# Altium schematic sheet nguyenly.SchDoc
size A; SheetNumber: 1; SheetTotal: 1
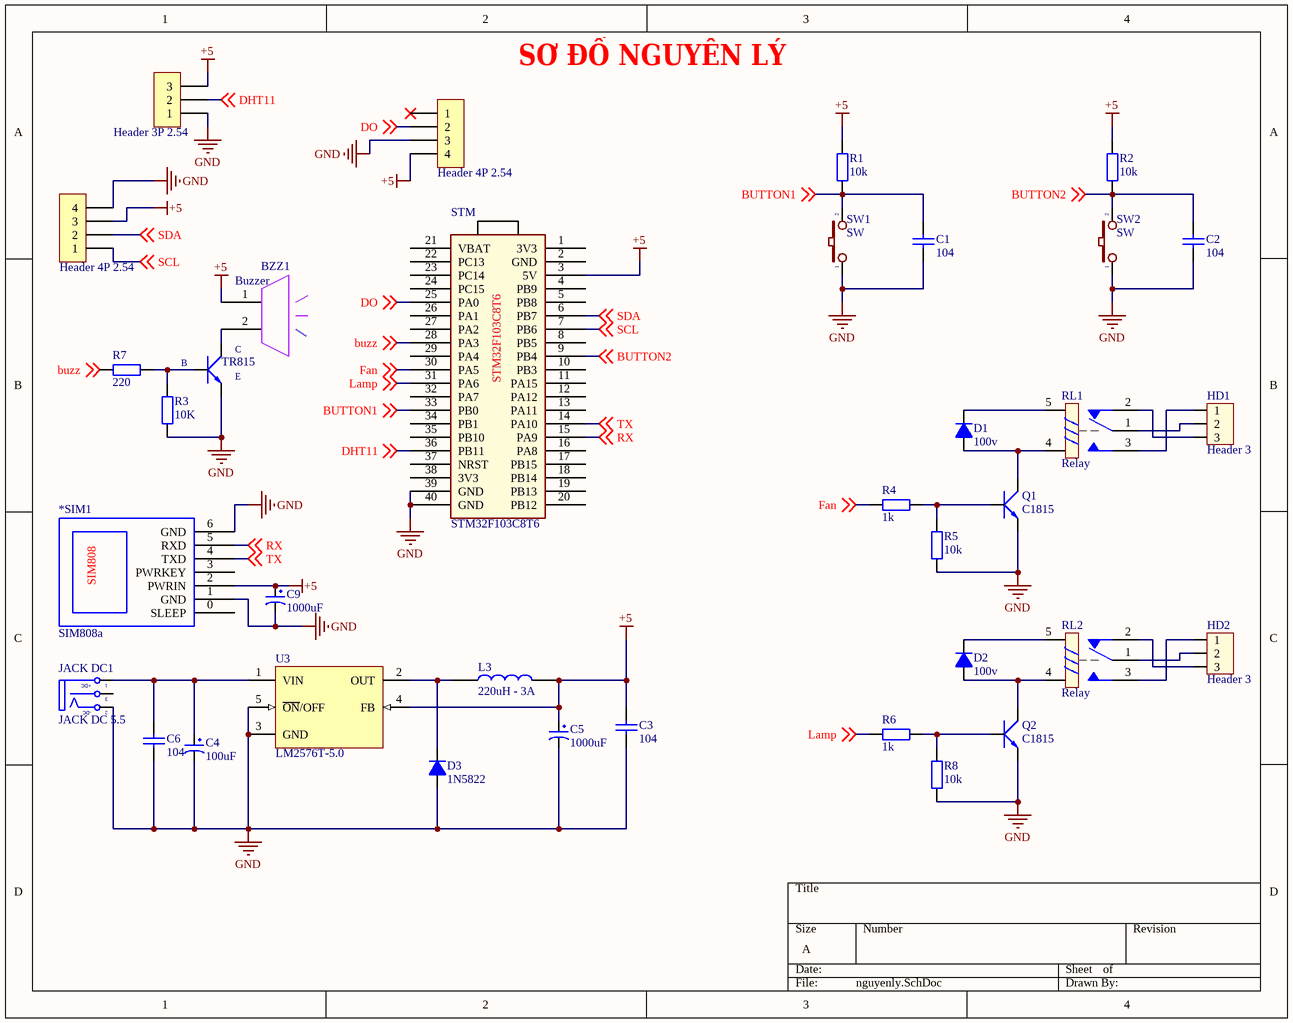
[diagram p0: nguyenly.SchDoc]

## Parts
*SIM1  SIM808a  [PCBComponent_1]
BZZ1  Buzzer  [buzzer 5V]
C1  104  [tu gom]
C2  104  [tu gom]
C3  104  [tu gom]
C4  100uF  [tu hoa 5mm]
C5  1000uF  [tu hoa 5mm]
C6  104  [tu gom]
C9  1000uF  [tu hoa 13mm]
D1  100v  [DIODE 1A]
D2  100v  [DIODE 1A]
D3  1N5822  [D5A]
H1  Header 4P 2.54  [XH2.54M-4]
H2  Header 3P 2.54  [XH2.54M-3]
H3  Header 4P 2.54  [XH2.54M-4]
HD1  Header 3  [HED3]
HD2  Header 3  [HED3]
JACK_DC1  JACK DC 5.5  [JACK DC 5.5]
L3  220uH - 3A  [CUON CAM 100uH3A]
Q1  C1815  [TO92]
Q2  C1815  [TO92]
R1  10k  [tro vach 1/2w]
R2  10k  [tro vach 1/2w]
R3  10K  [tro vach 1/2w]
R4  1k  [tro vach 1/2w]
R5  10k  [tro vach 1/2w]
R6  1k  [tro vach 1/2w]
R7  220  [tro vach 1/2w]
R8  10k  [tro vach 1/2w]
RL1  Relay  [Relay 5 Chan SRD]
RL2  Relay  [Relay 5 Chan SRD]
STA.TR1  TR815  [QTO-92]
STM  STM32F103C8T6  [PCBComponent_1]
SW1  SW  [SW2]
SW2  SW  [SW2]
U3  LM2576T-5.0  [LM2576t]

## Nets
+5: *SIM1.2(PWRIN) BZZ1.1 C3.1 C5.1 C9.1 H1.4 H2.3 H3.3 L3.2 R1.2 R2.2 STM.3(5V) U3.4(FB)
GND: *SIM1.1(GND) *SIM1.6(GND) C1.2 C2.2 C3.2 C4.2 C5.2 C6.2 C9.2 D3.1(A) H1.3 H2.1 H3.4 JACK_DC1.2(TN) Q1.1(E) Q2.1(E) R3.1 R5.1 R8.1 STA.TR1.1(E) STM.39(GND) STM.40(GND) SW1.1 SW2.1 U3.3(GND) U3.5(~{ON}/OFF)
BUTTON1: C1.1 R1.1 STM.33(PB0) SW1.2 ; off-sheet BUTTON1
BUTTON2: C2.1 R2.1 STM.9(PB4) SW2.2 ; off-sheet BUTTON2
buzz: R7.1 STM.28(PA3) ; off-sheet buzz
DHT11: H2.2 STM.36(PB11) ; off-sheet DHT11
DO: H1.2 STM.25(PA0) ; off-sheet DO
Fan: R4.1 STM.30(PA5) ; off-sheet Fan
Lamp: R6.1 STM.31(PA6) ; off-sheet Lamp
RX: *SIM1.5(RXD) STM.15(PA9) ; off-sheet RX
SCL: H3.1 STM.7(PB6) ; off-sheet SCL
SDA: H3.2 STM.6(PB7) ; off-sheet SDA
TX: *SIM1.4(TXD) STM.14(PA10) ; off-sheet TX
NetBZZ1_2: BZZ1.2 STA.TR1.2(C)
NetC4_1: C4.1 C6.1 JACK_DC1.1(T) U3.1(VIN)
NetD1_1: D1.1(A) Q1.2(C) RL1.4
NetD1_2: D1.2(K) RL1.5
NetD2_1: D2.1(A) Q2.2(C) RL2.4
NetD2_2: D2.2(K) RL2.5
NetD3_2: D3.2(K) L3.1 U3.2(OUT)
NetHD1_1: HD1.1 RL1.3
NetHD1_2: HD1.2 RL1.1
NetHD1_3: HD1.3 RL1.2
NetHD2_1: HD2.1 RL2.3
NetHD2_2: HD2.2 RL2.1
NetHD2_3: HD2.3 RL2.2
NetQ1_3: Q1.3(B) R4.2 R5.2
NetQ2_3: Q2.3(B) R6.2 R8.2
NetR3_2: R3.2 R7.2 STA.TR1.3(B)

Not connected (* = marked no-connect by the designer): *SIM1 0(SLEEP) 3(PWRKEY); H1 1*; JACK_DC1 3(S); STM 1(3V3) 2(GND) 4(PB9) 5(PB8) 8(PB5) 10(PB3) 11(PA15) 12(PA12) 13(PA11) 16(PA8) 17(PB15) 18(PB14) 19(PB13) 20(PB12) 21(VBAT) 22(PC13) 23(PC14) 24(PC15) 26(PA1) 27(PA2) 29(PA4) 32(PA7) 34(PB1) 35(PB10) 37(NRST) 38(3V3)

## Notes on the sheet
- SƠ ĐỒ NGUYÊN LÝ
- (in symbol JACK DC 5.5) +DC; -DC
- (in symbol SIM808a) SIM808

## Library data of the parts
C1-C3 C6 = Tu gom 104 50V: Cắm; So_Chan: 2; Ten_Linh_Kien: Tụ gốm 104 100nF 50V; Don_Vi: Con; Ma_Hang: MH004761; Chung_Loai: Cắm; Kieu_Chan: *
C4 C5 = Tu Hoa 100uF 16V 5x7: Cắm; Don_Vi: Con; So_Chan: 2; Ten_Linh_Kien: Tụ Hóa 100uF 16V 5x7MM; Ma_Hang: MH001347; Chung_Loai: Cắm; Kieu_Chan: *
C9 = Tu Hoa 1000uF 25V 13x21: Cắm; Don_Vi: Con; So_Chan: 2; Ten_Linh_Kien: Tụ Hóa 1000uF 25V 13x21MM; Ma_Hang: MH002315; Chung_Loai: Cắm; Kieu_Chan: *
D1 D2 = Diode 1N4007: Cắm; Ten_Linh_Kien: Diode 1N4007 1A (DIP); Don_Vi: Con; Ma_Hang: MH001063; Ghi Chu: *; Kieu_Chan: *; Chung_Loai: Cắm
D3 = D5A: Diode 5A; Value: 1N5408
H1 H3 = Header 4P 2.54 Duc Thang: Cắm; Ten_Linh_Kien: Header 4P XH2.54-4P Đực Thẳng; Don_Vi: Con; Ma_Hang: MH001285; Chung_Loai: Cắm
H2 = Header 3P 2.54 Duc Thang: Cắm; Ten_Linh_Kien: Header 3P XH2.54-3P Đực Thẳng; Don_Vi: Con; Ma_Hang: MH001292; Chung_Loai: Cắm
HD1 HD2 = Header 3: Header 3 (Green); Value: Header 3
JACK_DC1 = JACK DC 5.5: Value: Jac DC
L3 = CUON CAM 470uH DIP: Cắm; Don_Vi: Con; Ma_Hang: MH002232; Ten_Linh_Kien: Cuộn Cảm 470uH 3A 8x10MM; Ghi_Chu: *; Kieu_Chan: *; Chung_Loai: Cắm
Q1 Q2 = Trans C1815 DIP: NPN transistor; Value: C9014
R1-R8 = Tro Vach 1/2W 5% 1k: Cắm; Don_Vi: Con; So_Chan: 2; Ten_Linh_Kien: Trở 5% 1/2w 1K; Ma_Hang: MH007240; Chung_Loai: Cắm; Kieu_Chan: *
RL1 RL2 = Relay 5 Chan SRD: Relay 5 Chan; Ma_Hang: MH009374; Ten: Relay 5V10A SRD-05VDC-SL-C Chính Hãng
STA.TR1 = C1815: NPN 600mW, ECB; Value: C1815
STM = STM32
SW1 SW2 = SW2: Switch button 2 pin; Value: SW chip 2 pin
U3 = LM2576T-5.0: SIMPLE SWITCHER; 3A Step-Down Voltage Regulator; Manufacturer: National Semiconductor; PackageTopMarking: NSUZXYTT*LM2576T*-5.0 P+; PowerWise: N; FirstPublished: 4-Dec-2008; DatasheetVersion: Aug-2004; PackageVersion: revJ, Jan-1992; PackageReference: T05A; Publisher: Altium Limited; PackageDescription: TO-220, Molded, 5 Lead, Straight; CompType: Switcher; PartNumber: LM2576T-5.0; RoHS: O; PinCount: 5; DigiKeyPartNumber: LM2576T-5.0-ND; Code_JEDEC: TO-220-AB; ComponentLink1Description: LM2576 Datasheet; ComponentLink1URL: http://www.national.com/ds/LM/LM2576.pdf; ComponentLink2Description: LM2576 Web Page; ComponentLink2URL: http://www.national.com/pf/LM/LM2576.html; ComponentLink3Description: T05A Package Page; ComponentLink3URL: http://www.national.com/packaging/folders/t05a.html